# Altium schematic sheet LEDs.SchDoc
size A4; SheetNumber: 5; SheetTotal: 8
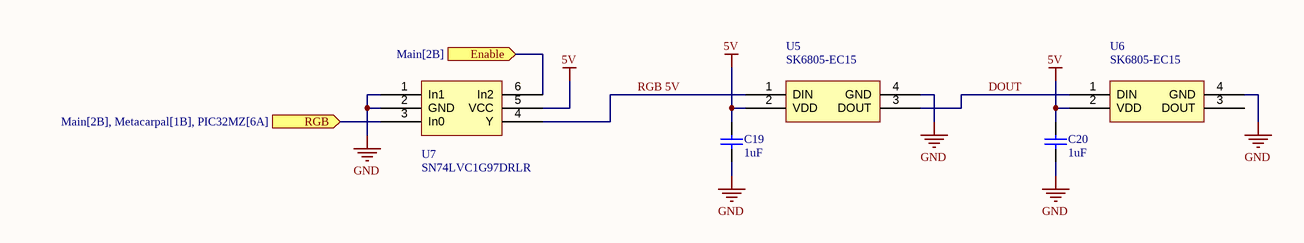
[diagram p0: LEDs.SchDoc]

## Parts
C19  1uF  [Capacitor 0402]
C20  1uF  [Capacitor 0402]
U5  SK6805-EC15  [SK6805-EC15]
U6  SK6805-EC15  [SK6805-EC15]
U7  SN74LVC1G97DRLR  [SOT-666]

## Ports
Enable (in, see Main[2B]), RGB (in, see Main[2B], Metacarpal[1B], PIC32MZ[6A])

## Nets
5V: C19.2 C20.2 U5.2(VDD) U6.2(VDD) U7.5(VCC)
GND: C19.1 C20.1 U5.4(GND) U6.4(GND) U7.1(In1) U7.2(GND)
DOUT: U5.3(DOUT) U6.1(DIN)
Enable: U7.6(In2) ; port Enable
RGB: U7.3(In0) ; port RGB
RGB 5V: U5.1(DIN) U7.4(Y)

Not connected (* = marked no-connect by the designer): U6 3(DOUT)

## Notes on the sheet
- TITLE
- SIZE
- A4
- VARIANT
- PROJECT
- SHEET
- VERSION
- OF
- AUTHOR
- DATE

## Library data of the parts
C19 C20 = Capacitor